# EAGLE schematic STPM01_230VAC_Rogowski (EAGLE 6.5.0)
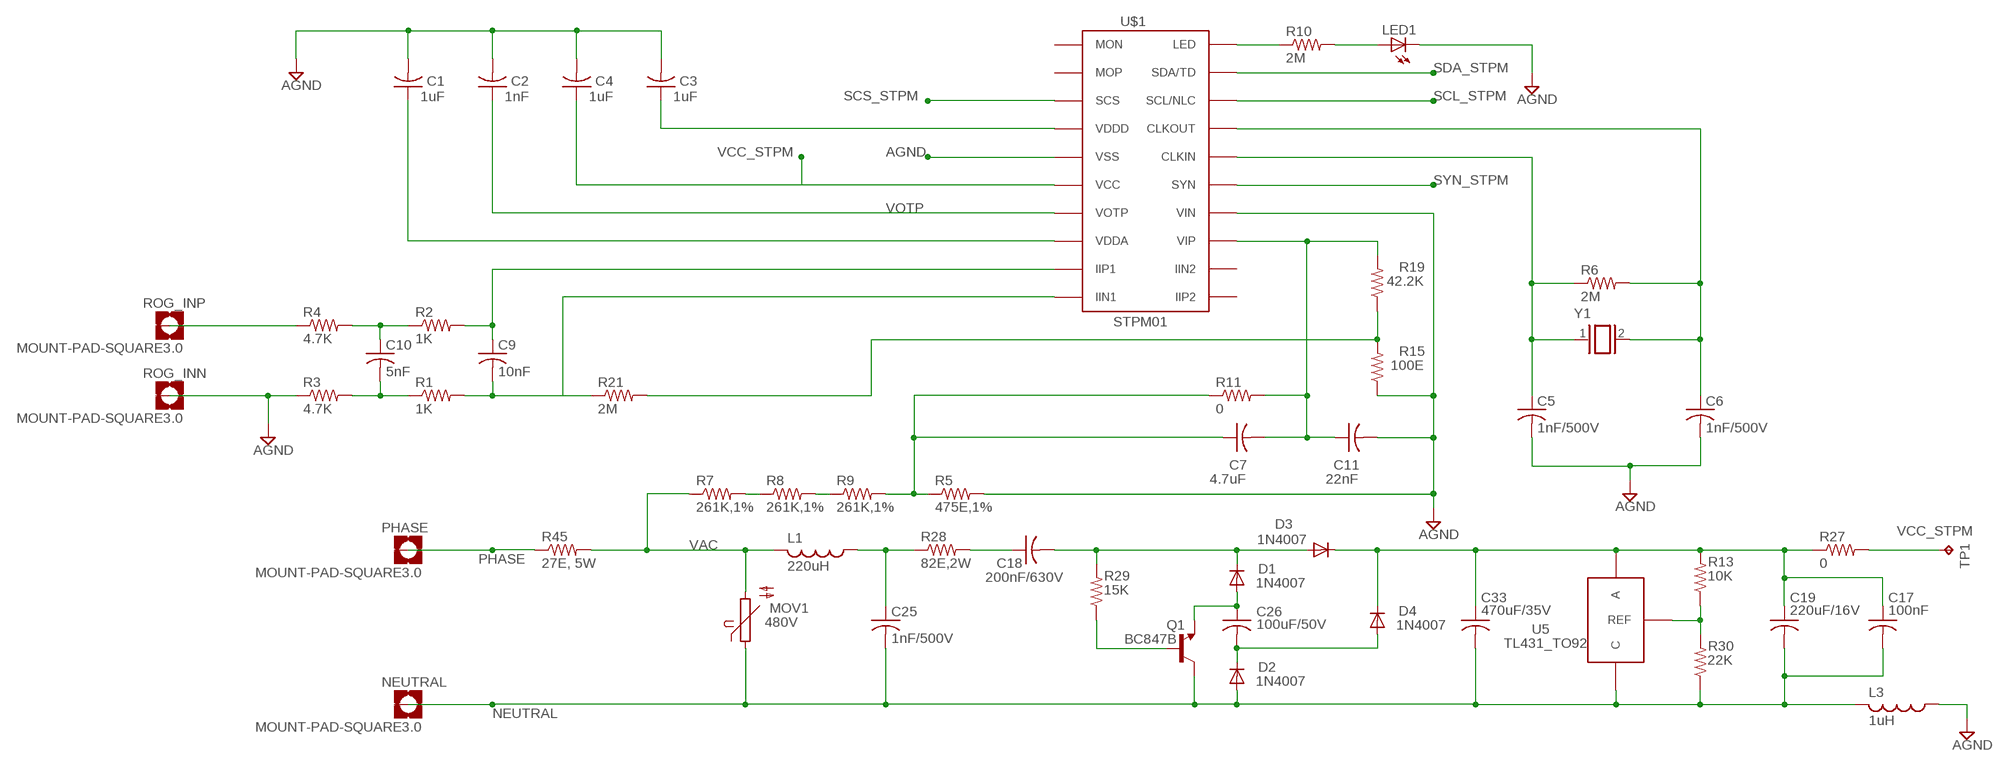
[diagram p0: schematic, sheet 1]

## Parts
C1  1uF  C-US025-060X050  [C025-060X050]
C2  1nF  C-US025-060X050  [C025-060X050]
C3  1uF  C-US025-060X050  [C025-060X050]
C4  1uF  C-US025-060X050  [C025-060X050]
C5  1nF/500V  C-US025-060X050  [C025-060X050]
C6  1nF/500V  C-US025-060X050  [C025-060X050]
C7  4.7uF  C-US050-024X044  [C050-024X044]
C9  10nF  C-US025-060X050  [C025-060X050]
C10  5nF  C-US025-060X050  [C025-060X050]
C11  22nF  C-US050-024X044  [C050-024X044]
C17  100nF  C-US025-060X050  [C025-060X050]
C18  200nF/630V  C-US050-024X044  [C050-024X044]
C19  220uF/16V  C-US025-060X050  [C025-060X050]
C25  1nF/500V  C-US025-060X050  [C025-060X050]
C26  100uF/50V  C-US050-030X075  [C050-030X075]
C33  470uF/35V  C-US025-060X050  [C025-060X050]
D1  1N4007  1N4004  [DO41-10]
D2  1N4007  1N4004  [DO41-10]
D3  1N4007  1N4004  [DO41-10]
D4  1N4007  1N4004  [DO41-10]
L1  220uH  L-US0204/5  [0204/5]
L3  1uH  L-US0204/5  [0204/5]
LED1  LEDSMT1206  [1206]
MOV1  480V  S14K550  [S14K550]
NEUTRAL  MOUNT-PAD-SQUARE3.0  [3,0-PAD-SQUARE]
PHASE  MOUNT-PAD-SQUARE3.0  [3,0-PAD-SQUARE]
Q1  BC847B  BC847  [SOT23]
R1  1K  R-US_0922V  [0922V]
R2  1K  R-US_0922V  [0922V]
R3  4.7K  R-US_0922V  [0922V]
R4  4.7K  R-US_0922V  [0922V]
R5  475E,1%  R-US_0922V  [0922V]
R6  2M  R-US_0922V  [0922V]
R7  261K,1%  R-US_0922V  [0922V]
R8  261K,1%  R-US_0922V  [0922V]
R9  261K,1%  R-US_0922V  [0922V]
R10  2M  R-US_0922V  [0922V]
R11  0  R-US_0922V  [0922V]
R13  10K  R-US_0204/5  [0204/5]
R15  100E  R-US_0204/5  [0204/5]
R19  42.2K  R-US_0204/5  [0204/5]
R21  2M  R-US_0922V  [0922V]
R27  0  R-US_0204/5  [0204/5]
R28  82E,2W  R-US_0204/5  [0204/5]
R29  15K  R-US_0204/5  [0204/5]
R30  22K  R-US_0204/5  [0204/5]
R45  27E, 5W  R-US_0922V  [0922V]
ROG_INN  MOUNT-PAD-SQUARE3.0  [3,0-PAD-SQUARE]
ROG_INP  MOUNT-PAD-SQUARE3.0  [3,0-PAD-SQUARE]
TP1  TPB2,54  [B2,54]
U5  TL431_TO92  TL431AIZ  [TO92-]
U$1  STPM01  [TSSOP20]
Y1  XTAL/S  [QS]

## Nets
AGND: C1.2 C2.2 C3.2 C4.2 C5.2 C6.2 C11.2 L3.1 LED1.C R3.1 R5.2 R15.1 U$1.P$5(VSS) U$1.P$14(VIN)
IIN1: C9.2 R1.2 R21.1 U$1.P$10(IIN1)
IIP1: C9.1 R2.2 U$1.P$9(IIP1)
N$1: C25.1 L1.1 R28.1
N$2: C18.1 R28.2
N$3: C18.2 D1.C D3.A R29.2
N$4: Q1.1(B) R29.1
N$5: C26.1 D1.A Q1.2(E)
N$6: C26.2 D2.C D4.A
N$7: C17.1 C19.1 C33.1 D3.C D4.C R13.2 R27.1 U5.2(A)
N$8: R13.1 R30.2 U5.3(REF)
N$9: C3.1 U$1.P$4(VDDD)
N$10: C10.2 R1.1 R3.2
N$11: C10.1 R2.1 R4.2
N$12: C1.1 U$1.P$8(VDDA)
N$13: R7.2 R8.1
N$14: R8.2 R9.1
N$15: R4.1
N$16: C5.1 R6.1 U$1.P$16(CLKIN) Y1.1
N$17: C6.1 R6.2 U$1.P$17(CLKOUT) Y1.2
N$18: R15.2 R19.1 R21.2
N$19: C7.1 R5.1 R9.2 R11.1
N$23: R10.1 U$1.P$20(LED)
N$24: LED1.A R10.2
NEUTRAL: C17.2 C19.2 C25.2 C33.2 D2.A L3.2 MOV1.1 Q1.3(C) R30.1 U5.1(C)
PHASE: R45.1
SCL_STPM: U$1.P$18(SCL/NLC)
SCS_STPM: U$1.P$3(SCS)
SDA_STPM: U$1.P$19(SDA/TD)
SYN_STPM: U$1.P$15(SYN)
VAC: L1.2 MOV1.2 R7.1 R45.2
VCC_STPM: C4.1 R27.2 TP1.TP U$1.P$6(VCC)
VIP: C7.2 C11.1 R11.2 R19.2 U$1.P$13(VIP)
VOTP: C2.1 U$1.P$7(VOTP)
Unconnected: NEUTRAL.B3,0(MOUNT) PHASE.B3,0(MOUNT) ROG_INN.B3,0(MOUNT) ROG_INP.B3,0(MOUNT) U$1.P$1(MON) U$1.P$2(MOP) U$1.P$11(IIP2) U$1.P$12(IIN2)

## Library data of the parts
C1-C7 C9-C11 C17-C19 C25 C33 = resistor:C-US: CAPACITOR, American symbol
C26 = rcl:C-US: CAPACITOR, American symbol
D1-D4 = diode:1N4004: DIODE general purpose rectifier, 1 A
L1 L3 = resistor:L-US: INDUCTOR, American symbol
LED1 = led:LED: LED OSRAM: - CHIPLED LG R971, LG N971, LY N971, LG Q971, LY Q971, LO R971, LY R971 LH N974, LH R974 LS Q976, LO Q976, LY Q976 LO Q996 - Hyper CHIPLED LW Q18S LB Q993, LB Q99A, LB R99A - SideLED LS A670, LO A670, LY A670, LG A670, LP A670 LB A673, LV A673, LT A673, LW A673 LH A674 LY A675 LS A676, LA A676, LO A676, LY A676, LW A676 LS A679, LY A679, LG A679 - Hyper Micro SIDELED® LS Y876, LA Y876, LO Y876, LY Y876 LT Y87S - SmartLED LW L88C, LW L88S LB L89C, LB L89S, LG L890 LS L89K, LO L89K, LY L89K LS L896, LA L896, LO L896, LY L896 - TOPLED LS T670, LO T670, LY T670, LG T670, LP T670 LSG T670, LSP T670, LSY T670, LOP T670, LYG T670 LG T671, LOG T671, LSG T671 LB T673, LV T673, LT T673, LW T673 LH T674 LS T676, LA T676, LO T676, LY T676, LB T676, LH T676, LSB T676, LW T676 LB T67C, LV T67C, LT T67C, LS T67K, LO T67K, LY T67K, LW E67C LS E67B, LA E67B, LO E67B, LY E67B, LB E67C, LV E67C, LT E67C LW T67C LS T679, LY T679, LG T679 LS T770, LO T770, LY T770, LG T770, LP T770 LB T773, LV T773, LT T773, LW T773 LH T774 LS E675, LA E675, LY E675, LS T675 LS T776, LA T776, LO T776, LY T776, LB T776 LHGB T686 LT T68C, LB T68C - Hyper Mini TOPLED® LB M676 - Mini TOPLED Santana® LG M470 LS M47K, LO M47K, LY M47K Source: http://www.osram.convergy.de LUXEON: - LUMILED® LXK2-PW12-R00, LXK2-PW12-S00, LXK2-PW14-U00, LXK2-PW14-V00 LXK2-PM12-R00, LXK2-PM12-S00, LXK2-PM14-U00 LXK2-PE12-Q00, LXK2-PE12-R00, LXK2-PE12-S00, LXK2-PE14-T00, LXK2-PE14-U00 LXK2-PB12-K00, LXK2-PB12-L00, LXK2-PB12-M00, LXK2-PB14-N00, LXK2-PB14-P00, LXK2-PB14-Q00 LXK2-PR12-L00, LXK2-PR12-M00, LXK2-PR14-Q00, LXK2-PR14-R00 LXK2-PD12-Q00, LXK2-PD12-R00, LXK2-PD12-S00 LXK2-PH12-R00, LXK2-PH12-S00 LXK2-PL12-P00, LXK2-PL12-Q00, LXK2-PL12-R00 Source: www.luxeon.com KINGBRIGHT: KA-3528ASYC Source: www.kingbright.com
MOV1 = varistor:S14K550: VARISTOR
NEUTRAL PHASE ROG_INN ROG_INP = holes:MOUNT-PAD-SQUARE: MOUNTING PAD, square
Q1 = transistor:BC847: NPN TRANSISTOR
R1-R11 R13 R15 R19 R21 R27-R30 R45 = resistor:R-US_: RESISTOR, American symbol
TP1 = testpad:TP: Test pad
U5 = BinarySpace:TL431AIZ
U$1 = BinarySpace:STPM01
Y1 = special:XTAL/S: CRYSTAL